# Altium schematic sheet Screen_Interface.SchDoc
size C; SheetNumber: 6; SheetTotal: 8
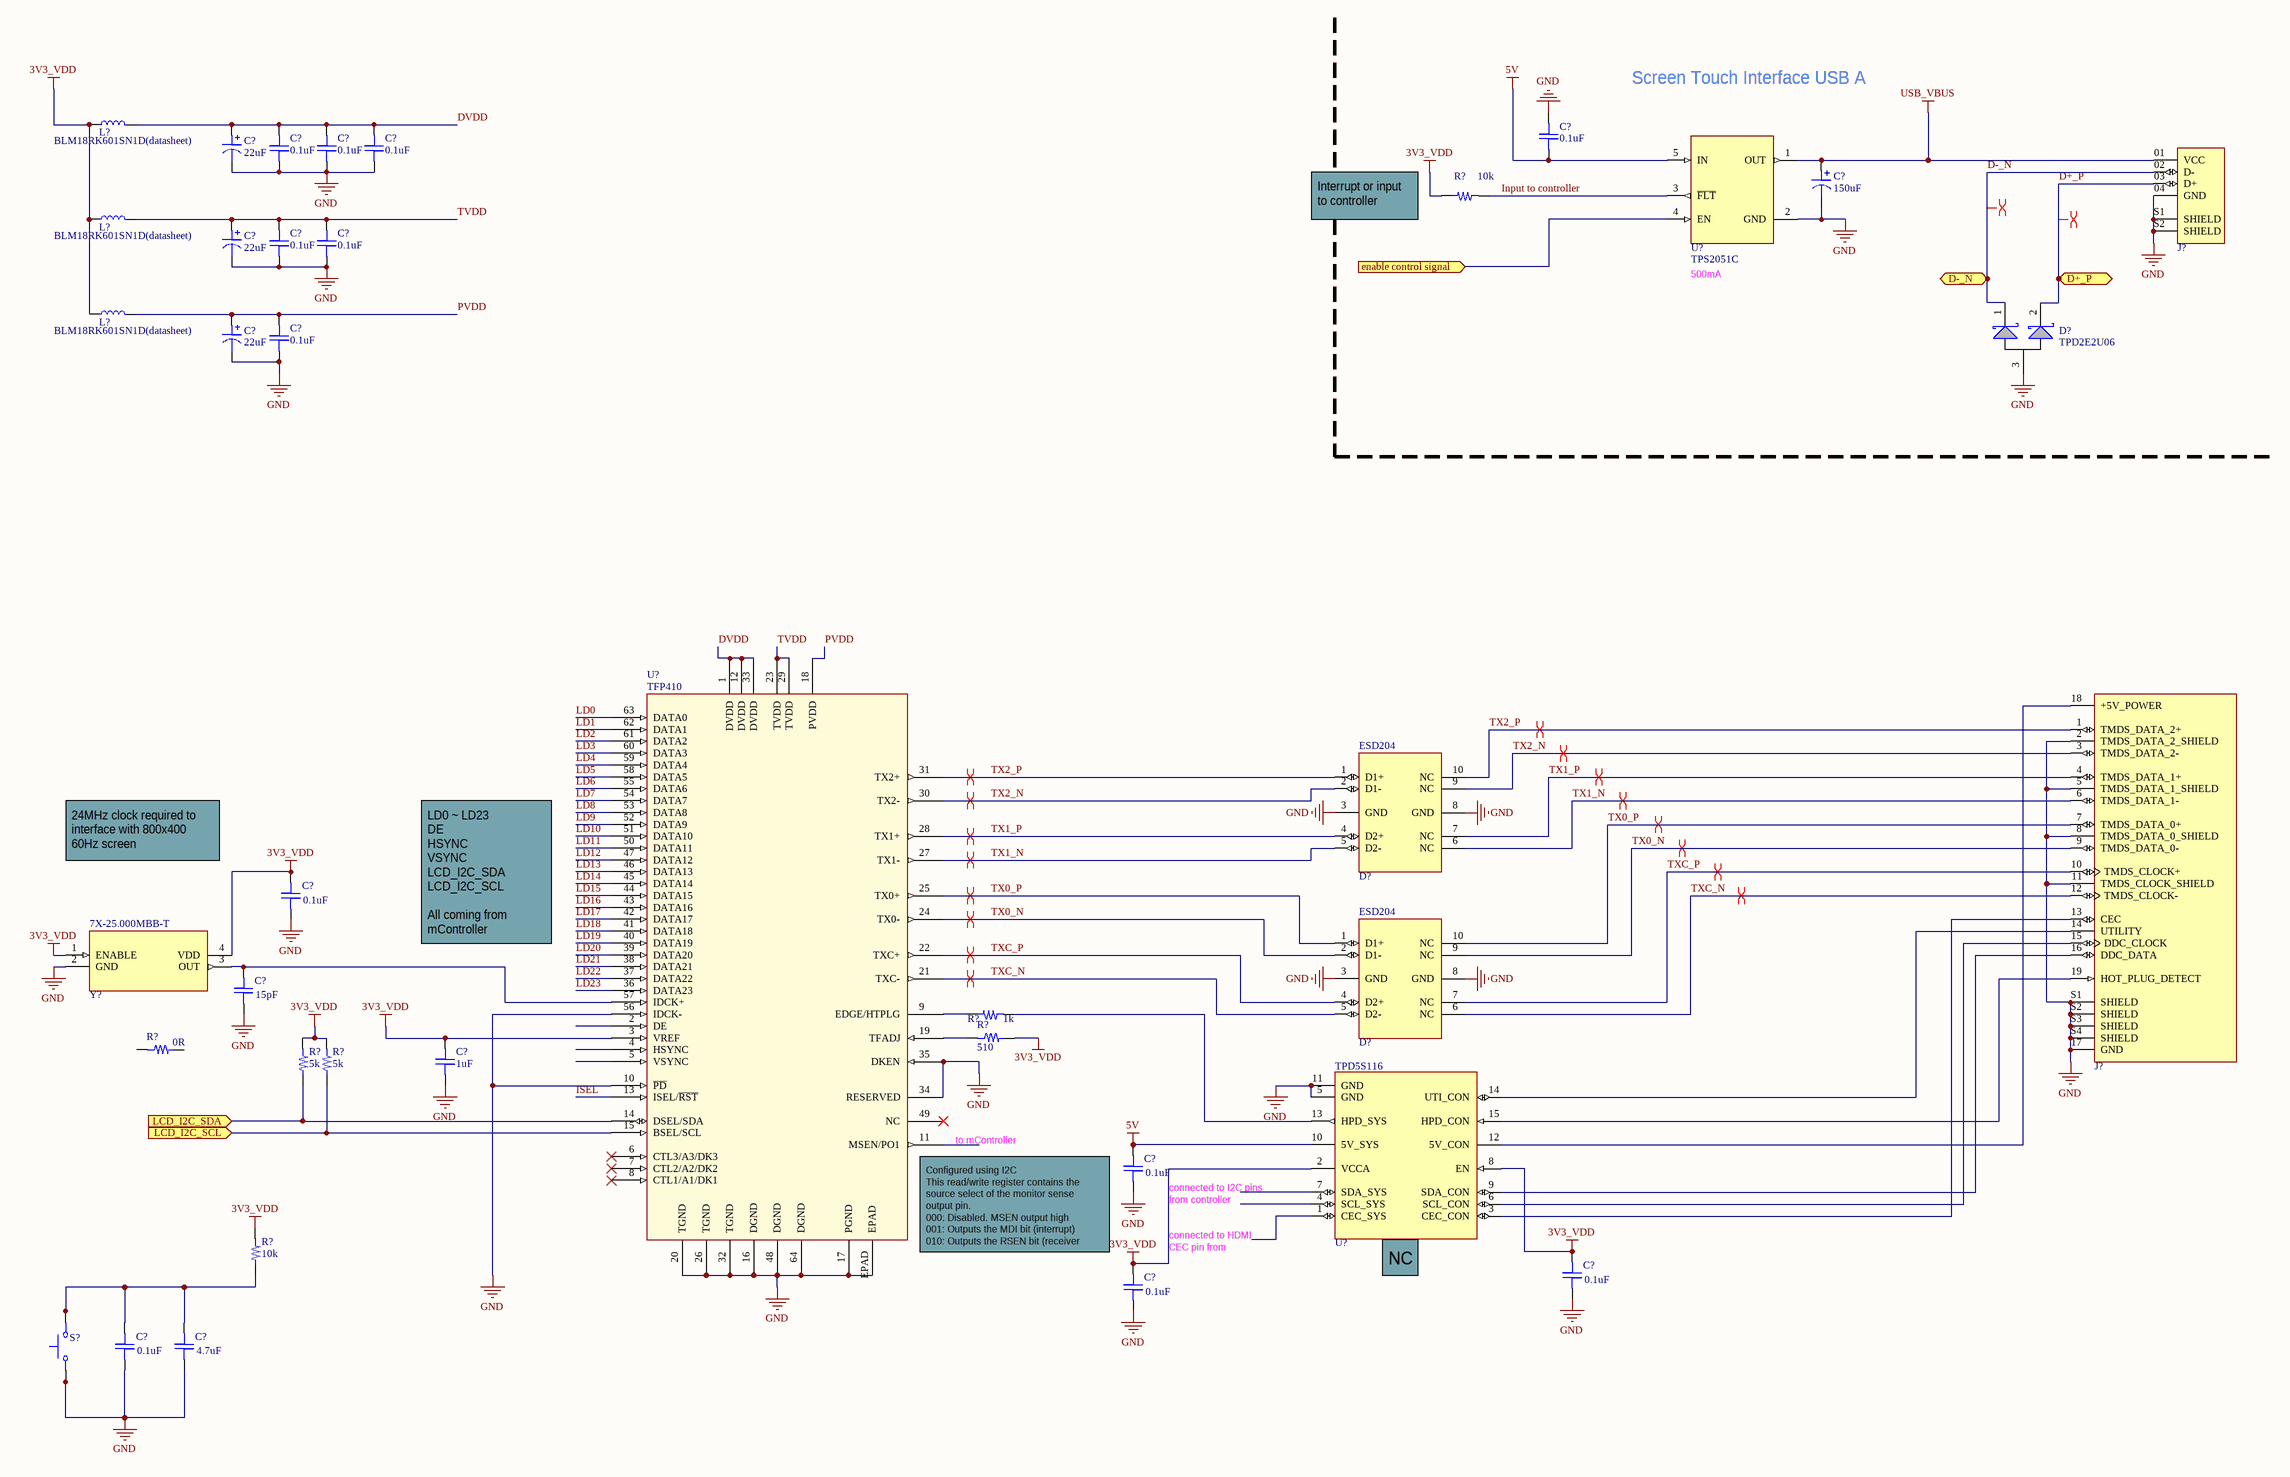
[diagram p0: Screen_Interface.SchDoc]

## Parts
(Parts that share a designator on the sheet are numbered #1, #2 ... from top to bottom, then left to right.)
C?#1  0.1uF  [C0402]
C?#2  value 22uF  [C_CASE-D-7343]  (hidden comment: Polarized Capacitor)
C?#3  0.1uF  [C0402]
C?#4  0.1uF  [C0402]
C?#5  0.1uF  [C0402]
C?#6  value 150uF  [C_CASE-D-7343]  (hidden comment: Polarized Capacitor)
C?#7  value 22uF  [C_CASE-D-7343]  (hidden comment: Polarized Capacitor)
C?#8  0.1uF  [C0402]
C?#9  0.1uF  [C0402]
C?#10  value 22uF  [C_CASE-D-7343]  (hidden comment: Polarized Capacitor)
C?#11  0.1uF  [C0402]
C?#12  value 0.1uF  [C0402]  (hidden comment: Capacitor)
C?#13  value 15pF  [C0402]  (hidden comment: Capacitor)
C?#14  1uF  [C0402]
C?#15  value 0.1uF  [C0402]  (hidden comment: Capacitor)
C?#16  value 0.1uF  [C0402]  (hidden comment: Capacitor)
C?#17  value 0.1uF  [C0402]  (hidden comment: Capacitor)
C?#18  value 0.1uF  [C0402]  (hidden comment: Capacitor)
C?#19  value 4.7uF  [C0402]  (hidden comment: Capacitor)
D?#1  value TPD2E2U06  [SOT-23-3]  (hidden comment: ESD Protection)
D?#2  value ESD204  [USON-10 (ESD204)]  (hidden comment: ESD Protection)
D?#3  value ESD204  [USON-10 (ESD204)]  (hidden comment: ESD Protection)
J?#1  USB Type A  [USB_TypeA_2.0]  (value not drawn)
J?#2  HDMI Type A  [HDMI TypeA SMD]  (value not drawn)
L?#1  value BLM18RK601SN1D(datasheet)  [L_0805]  (hidden comment: or we can use MMZ1608B102CTA00)
L?#2  value BLM18RK601SN1D(datasheet)  [L_0805]  (hidden comment: or we can use MMZ1608B102CTA00)
L?#3  value BLM18RK601SN1D(datasheet)  [L_0805]  (hidden comment: or we can use MMZ1608B102CTA00)
R?#1  value 10k  [R0402]  (hidden comment: Resistor)
R?#2  value 1k  [R0402]  (hidden comment: Resistor)
R?#3  value 5k  [R0402]  (hidden comment: Resistor)
R?#4  value 5k  [R0402]  (hidden comment: Resistor)
R?#5  value 510  [R0402]  (hidden comment: Resistor)
R?#6  value 0R  [R0402]  (hidden comment: Resistor)
R?#7  value 10k  [R0402]  (hidden comment: Resistor)
S?  Push Button 4 pin  [Push_Button(6x6mm)]  (value not drawn)
U?#1  value TPS2051C  [SOT-23-5]  (hidden comment: Current Limiting Power Switch)
U?#2  value TPD5S116  [DSBGA-15 (TPD5S116)]  (hidden comment: HDMI companion chip)
U?#3  value TFP410  [TFP410 (HTQFP-64)]
Y?  value 7X-25.000MBB-T  [7X-25.000MBB-T]  (hidden comment: Oscillator)

## Ports
D+_P (bidir), D-_N (bidir), enable control signal (in), LCD_I2C_SCL (in), LCD_I2C_SDA (in)

## Nets
3V3_VDD: C?#12.1 C?#14.1 C?#16.1 C?#17.1 L?#1.1 L?#2.1 L?#3.1 R?#1.1 R?#3.1 R?#4.1 R?#5.1 R?#7.1 U?#2.2(VCCA) U?#2.8(EN) U?#3.3(VREF) Y?.1(ENABLE) Y?.4(VDD)
5V: C?#1.1 C?#15.1 U?#1.5(IN) U?#2.10(5V_SYS)
GND: C?#1.1 C?#2.1 C?#3.1 C?#4.1 C?#5.1 C?#6.1 C?#7.1 C?#8.1 C?#9.1 C?#10.1 C?#11.1 C?#12.1 C?#13.1 C?#14.1 C?#15.1 C?#16.1 C?#17.1 C?#18.1 C?#19.1 D?#1.3(A) D?#2.3(GND) D?#2.8(GND) D?#3.3(GND) D?#3.8(GND) J?#1.04(GND) J?#1.S1(SHIELD) J?#1.S2(SHIELD) J?#2.2(TMDS_DATA_2_SHIELD) J?#2.5(TMDS_DATA_1_SHIELD) J?#2.8(TMDS_DATA_0_SHIELD) J?#2.11(TMDS_CLOCK_SHIELD) J?#2.17(GND) J?#2.S1(SHIELD) J?#2.S2(SHIELD) J?#2.S3(SHIELD) J?#2.S4(SHIELD) S?.1 S?.2 U?#1.2(GND) U?#2.5(GND) U?#2.11(GND) U?#3.10(~{PD}) U?#3.16(DGND) U?#3.17(PGND) U?#3.20(TGND) U?#3.26(TGND) U?#3.32(TGND) U?#3.34(RESERVED) U?#3.35(DKEN) U?#3.48(DGND) U?#3.56(IDCK-) U?#3.64(DGND) U?#3.EPAD Y?.2(GND)
USB_VBUS: C?#6.1 J?#1.01(VCC) U?#1.1(OUT)
D+_P: D?#1.2(K2) J?#1.03(D+) ; port D+_P
D-_N: D?#1.1(K1) J?#1.02(D-) ; port D-_N
DVDD: C?#2.1 C?#3.1 C?#4.1 C?#5.1 L?#1.2 U?#3.1(DVDD) U?#3.12(DVDD) U?#3.33(DVDD)
enable control signal: U?#1.4(EN) ; port enable control signal
Input to controller: R?#1.1 U?#1.3(~{FLT})
ISEL: U?#3.13(ISEL/~{RST})
LCD_I2C_SCL: R?#4.1 U?#3.15(BSEL/SCL) ; port LCD_I2C_SCL
LCD_I2C_SDA: R?#3.1 U?#3.14(DSEL/SDA) ; port LCD_I2C_SDA
LD0: U?#3.63(DATA0)
LD1: U?#3.62(DATA1)
LD2: U?#3.61(DATA2)
LD3: U?#3.60(DATA3)
LD4: U?#3.59(DATA4)
LD5: U?#3.58(DATA5)
LD6: U?#3.55(DATA6)
LD7: U?#3.54(DATA7)
LD8: U?#3.53(DATA8)
LD9: U?#3.52(DATA9)
LD10: U?#3.51(DATA10)
LD11: U?#3.50(DATA11)
LD12: U?#3.47(DATA12)
LD13: U?#3.46(DATA13)
LD14: U?#3.45(DATA14)
LD15: U?#3.44(DATA15)
LD16: U?#3.43(DATA16)
LD17: U?#3.42(DATA17)
LD18: U?#3.41(DATA18)
LD19: U?#3.40(DATA19)
LD20: U?#3.39(DATA20)
LD21: U?#3.38(DATA21)
LD22: U?#3.37(DATA22)
LD23: U?#3.36(DATA23)
PVDD: C?#10.1 C?#11.1 L?#3.2 U?#3.18(PVDD)
TVDD: C?#7.1 C?#8.1 C?#9.1 L?#2.2 U?#3.23(TVDD) U?#3.29(TVDD)
TX0_N: D?#3.2(D1-) D?#3.9(NC) J?#2.9(TMDS_DATA_0-) U?#3.24(TX0-)
TX0_P: D?#3.1(D1+) D?#3.10(NC) J?#2.7(TMDS_DATA_0+) U?#3.25(TX0+)
TX1_N: D?#2.5(D2-) D?#2.6(NC) J?#2.6(TMDS_DATA_1-) U?#3.27(TX1-)
TX1_P: D?#2.4(D2+) D?#2.7(NC) J?#2.4(TMDS_DATA_1+) U?#3.28(TX1+)
TX2_N: D?#2.2(D1-) D?#2.9(NC) J?#2.3(TMDS_DATA_2-) U?#3.30(TX2-)
TX2_P: D?#2.1(D1+) D?#2.10(NC) J?#2.1(TMDS_DATA_2+) U?#3.31(TX2+)
TXC_N: D?#3.5(D2-) D?#3.6(NC) J?#2.12(TMDS_CLOCK-) U?#3.21(TXC-)
TXC_P: D?#3.4(D2+) D?#3.7(NC) J?#2.10(TMDS_CLOCK+) U?#3.22(TXC+)
NetC?#13_1: C?#13.1 U?#3.57(IDCK+) Y?.3(OUT)
NetC?#18_1: C?#18.1 C?#19.1 R?#7.1 S?.3 S?.4
NetJ?#2_13: J?#2.13(CEC) U?#2.3(CEC_CON)
NetJ?#2_14: J?#2.14(UTILITY) U?#2.14(UTI_CON)
NetJ?#2_15: J?#2.15(DDC_CLOCK) U?#2.6(SCL_CON)
NetJ?#2_16: J?#2.16(DDC_DATA) U?#2.9(SDA_CON)
NetJ?#2_18: J?#2.18(+5V_POWER) U?#2.12(5V_CON)
NetJ?#2_19: J?#2.19(HOT_PLUG_DETECT) U?#2.15(HPD_CON)
NetR?#2_1: R?#2.1 U?#2.13(HPD_SYS)
NetR?#2_1: R?#2.1 U?#3.9(EDGE/HTPLG)  [a separate net that carries the same name]
NetR?#5_1: R?#5.1 U?#3.19(TFADJ)

Not connected (* = marked no-connect by the designer): R?#6 1; U?#2 1(CEC_SYS) 4(SCL_SYS) 7(SDA_SYS); U?#3 2(DE) 4(HSYNC) 5(VSYNC) 6(CTL3/A3/DK3)* 7(CTL2/A2/DK2)* 8(CTL1/A1/DK1)* 11(MSEN/PO1) 49(NC)*

## Layout directives
differential pair; differential pair class USB_D: D+_P, D-_N
differential pair; differential pair class HDMI_Diff: TX0_N, TX0_P, TX1_N, TX1_P, TX2_N, TX2_P, TXC_N, TXC_P

## Notes on the sheet
- Screen Touch Interface USB A
- (near R?#1) Interrupt or input to controller
- 500mA max
- 24MHz clock required to interface with 800x400 60Hz screen
- LD0 ~ LD23
  DE
  HSYNC
  VSYNC
  LCD_I2C_SDA
  LCD_I2C_SCL
  All coming from mController
- to mController
- (near U?#3) Configured using I2C
  This read/write register contains the source select of the monitor sense output pin.
  000: Disabled. MSEN output high
  001: Outputs the MDI bit (interrupt)
  010: Outputs the RSEN bit (receiver detect)
  011: Outputs the HTPLG bit (hot plug detect)
- (near C?#17) connected to HDMI CEC pin from controller
- (near C?#15) connected to I2C pins from controller
- (near U?#2) NC

## Library data of the parts
C?#1 C?#3-C?#5 C?#8 C?#9 C?#11-C?#19 = CAP_SMT: ComponentLink1Description: New link
C?#2 C?#6 C?#7 C?#10 = C_Polarized: ComponentLink1Description: New link
D?#1 = TPD2E2U06: Dual 1.5-pF, 5.5-V, ±25-kV ESD protection diode with 5.5-A 8/20-uS surge rating for USB 2.0; ComponentLink1Description: New link; ComponentLink1URL: *
D?#2 D?#3 = ESD204: ESD / Quad 0.55-pF, ±3.6-V, ±30-kV ESD protection diode with 5.5A surge rating for USB & HDMI; ComponentLink1Description: New link
J?#1 = USB_TypeA_2.0: ComponentLink1Description: New link
J?#2 = HDMI_TypeA: HDMI, Input Output Connectors, Receptacle, Type A, Right Angle, Surface Mount, 19 Positions.; ComponentLink1Description: New link
L?#1-L?#3 = Inductor_SMT: ComponentLink1Description: New link
R?#1-R?#7 = RES_SMT: ComponentLink1Description: New link; ComponentLink1URL: *
S? = Push_Button: Push Button SMD(6x6mm) 4 pin; ComponentLink1Description: New link
U?#1 = TPS2051C: Current Limiting Switch 0.5A loading, 4.5-5.5V, 97mΩ USB power switch, active-high, output discharge, reverse blocking; ComponentLink1Description: New link; ComponentLink1URL: *
U?#2 = TPD5S116: HDMI companion chip with 5-V load switch, level shifter, and ESD clamp; ComponentLink1Description: New link
U?#3 = TFP410: HDMI Transmitter - 165-MHz TMDS DVI transmitter/serializer & Panelbus; ComponentLink1Description: New link
Y? = 7X-25.000MBB-T: Standard Clock Oscillators 25.000MHz 3.3V50ppm(-10 +70C); ComponentLink1Description: New link